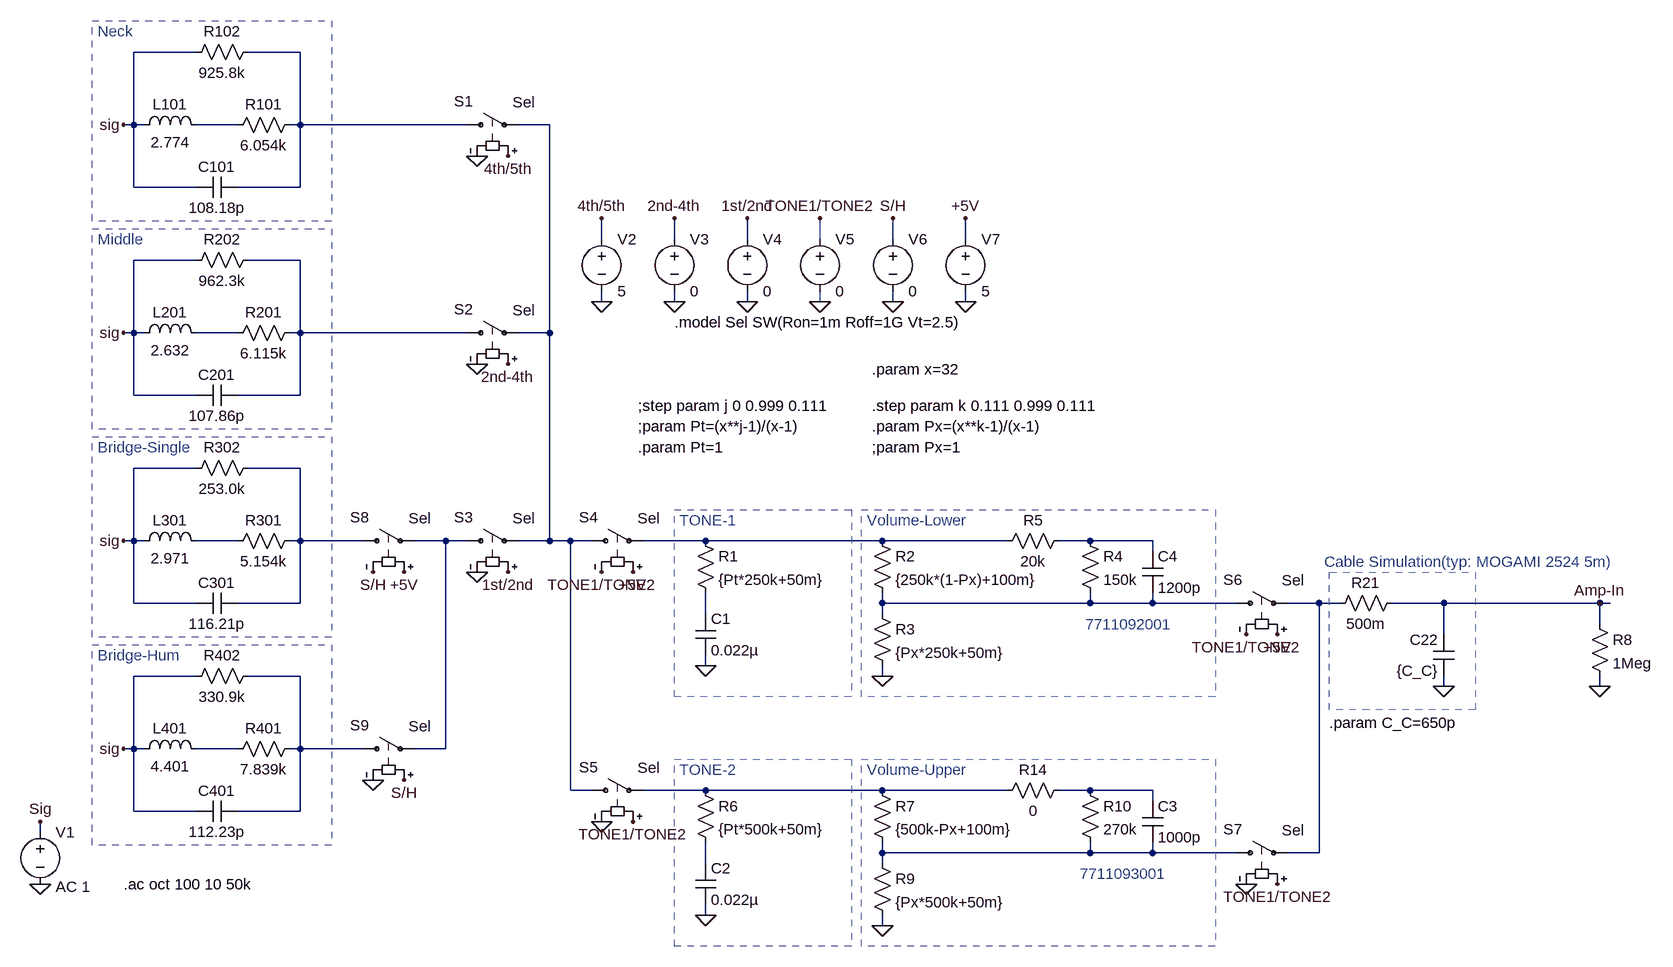
[diagram p0: schematic AM-Pro_Analysis.asc]
AM-Pro_Analysis.asc, the LTspice schematic file:
Version 4.1
SHEET 1 1576 1092
WIRE -672 -768 -768 -768
WIRE -512 -768 -592 -768
WIRE -768 -656 -768 -768
WIRE -768 -656 -784 -656
WIRE -752 -656 -768 -656
WIRE -608 -656 -672 -656
WIRE -512 -656 -512 -768
WIRE -512 -656 -528 -656
WIRE -256 -656 -512 -656
WIRE -128 -656 -176 -656
WIRE -768 -560 -768 -656
WIRE -672 -560 -768 -560
WIRE -512 -560 -512 -656
WIRE -512 -560 -608 -560
WIRE -48 -480 -48 -512
WIRE 64 -480 64 -512
WIRE 176 -480 176 -512
WIRE 288 -480 288 -512
WIRE 400 -480 400 -512
WIRE 512 -480 512 -512
WIRE -672 -448 -768 -448
WIRE -512 -448 -592 -448
WIRE -48 -384 -48 -400
WIRE 64 -384 64 -400
WIRE 176 -384 176 -400
WIRE 288 -384 288 -400
WIRE 400 -384 400 -400
WIRE 512 -384 512 -400
WIRE -768 -336 -768 -448
WIRE -768 -336 -784 -336
WIRE -752 -336 -768 -336
WIRE -608 -336 -672 -336
WIRE -512 -336 -512 -448
WIRE -512 -336 -528 -336
WIRE -256 -336 -512 -336
WIRE -128 -336 -128 -656
WIRE -128 -336 -176 -336
WIRE -768 -240 -768 -336
WIRE -672 -240 -768 -240
WIRE -512 -240 -512 -336
WIRE -512 -240 -608 -240
WIRE -672 -128 -768 -128
WIRE -512 -128 -592 -128
WIRE -768 -16 -768 -128
WIRE -768 -16 -784 -16
WIRE -752 -16 -768 -16
WIRE -608 -16 -672 -16
WIRE -512 -16 -512 -128
WIRE -512 -16 -528 -16
WIRE -416 -16 -512 -16
WIRE -288 -16 -336 -16
WIRE -256 -16 -288 -16
WIRE -128 -16 -128 -336
WIRE -128 -16 -176 -16
WIRE -96 -16 -128 -16
WIRE -64 -16 -96 -16
WIRE 112 -16 16 -16
WIRE 384 -16 112 -16
WIRE 576 -16 384 -16
WIRE 704 -16 656 -16
WIRE 800 -16 704 -16
WIRE 800 0 800 -16
WIRE -768 80 -768 -16
WIRE -672 80 -768 80
WIRE -512 80 -512 -16
WIRE -512 80 -608 80
WIRE 384 80 384 64
WIRE 704 80 704 64
WIRE 704 80 384 80
WIRE 800 80 800 64
WIRE 800 80 704 80
WIRE 928 80 800 80
WIRE 1056 80 1008 80
WIRE 1088 80 1056 80
WIRE 1248 80 1168 80
WIRE 1488 80 1248 80
WIRE 1504 80 1488 80
WIRE 112 96 112 64
WIRE 384 96 384 80
WIRE 1488 112 1488 80
WIRE 1248 128 1248 80
WIRE 112 176 112 160
WIRE -672 192 -768 192
WIRE -512 192 -592 192
WIRE 384 192 384 176
WIRE 1248 208 1248 192
WIRE 1488 208 1488 192
WIRE -768 304 -768 192
WIRE -768 304 -784 304
WIRE -752 304 -768 304
WIRE -608 304 -672 304
WIRE -512 304 -512 192
WIRE -512 304 -528 304
WIRE -416 304 -512 304
WIRE -288 304 -288 -16
WIRE -288 304 -336 304
WIRE -96 368 -96 -16
WIRE -64 368 -96 368
WIRE 112 368 16 368
WIRE 384 368 112 368
WIRE 576 368 384 368
WIRE 704 368 656 368
WIRE 800 368 704 368
WIRE 800 384 800 368
WIRE -768 400 -768 304
WIRE -672 400 -768 400
WIRE -512 400 -512 304
WIRE -512 400 -608 400
WIRE -912 432 -912 416
WIRE 384 464 384 448
WIRE 704 464 704 448
WIRE 704 464 384 464
WIRE 800 464 800 448
WIRE 800 464 704 464
WIRE 928 464 800 464
WIRE 1056 464 1056 80
WIRE 1056 464 1008 464
WIRE 112 480 112 448
WIRE 384 480 384 464
WIRE 112 560 112 544
WIRE 384 576 384 560
FLAG -912 512 0
FLAG 112 176 0
FLAG 384 192 0
FLAG 1248 208 0
FLAG 1488 80 Amp-In
FLAG 1488 208 0
FLAG -240 -608 0
FLAG -240 -288 0
FLAG -240 32 0
FLAG -48 -384 0
FLAG -48 -512 4th/5th
FLAG 64 -512 2nd-4th
FLAG 176 -512 1st/2nd
FLAG 64 -384 0
FLAG 176 -384 0
FLAG 288 -512 TONE1/TONE2
FLAG 288 -384 0
FLAG 400 -512 S/H
FLAG 400 -384 0
FLAG 0 32 +5V
FLAG -48 416 0
FLAG -192 32 1st/2nd
FLAG -192 -288 2nd-4th
FLAG -192 -608 4th/5th
FLAG 992 128 +5V
FLAG 944 512 0
FLAG 112 560 0
FLAG 384 576 0
FLAG -400 32 S/H
FLAG -352 32 +5V
FLAG -352 352 S/H
FLAG -400 352 0
FLAG -912 416 Sig
FLAG -784 -656 sig
FLAG 512 -512 +5V
FLAG 512 -384 0
FLAG -48 32 TONE1/TONE2
FLAG 0 416 TONE1/TONE2
FLAG 944 128 TONE1/TONE2
FLAG 992 512 TONE1/TONE2
FLAG -784 -336 sig
FLAG -784 304 sig
FLAG -784 -16 sig
SYMBOL voltage -912 416 R0
WINDOW 3 30 134 Left 2
WINDOW 123 24 100 Left 2
WINDOW 39 24 72 Left 2
SYMATTR Value ""
SYMATTR Value2 AC 1
SYMATTR InstName V1
SYMBOL cap 96 96 R0
SYMATTR InstName C1
SYMATTR Value 0.022µ
SYMBOL res 96 -32 R0
SYMATTR InstName R1
SYMATTR Value {Pt*250k+50m}
SYMBOL res 368 -32 R0
SYMATTR InstName R2
SYMATTR Value {250k*(1-Px)+100m}
SYMBOL res 368 80 R0
SYMATTR InstName R3
SYMATTR Value {Px*250k+50m}
SYMBOL res 688 -32 R0
SYMATTR InstName R4
SYMATTR Value 150k
SYMBOL cap 784 0 R0
SYMATTR InstName C4
SYMATTR Value 1200p
SYMBOL Res 1184 64 R90
WINDOW 0 0 56 VBottom 2
WINDOW 3 32 56 VTop 2
SYMATTR InstName R21
SYMATTR Value 500m
SYMBOL Cap 1264 192 R180
WINDOW 0 24 56 Left 2
WINDOW 3 24 8 Left 2
SYMATTR InstName C22
SYMATTR Value {C_C}
SYMBOL Res 1472 96 R0
SYMATTR InstName R8
SYMATTR Value 1Meg
SYMBOL res -512 -672 R90
WINDOW 0 0 56 VBottom 2
WINDOW 3 32 56 VTop 2
SYMATTR InstName R101
SYMATTR Value 6.054k
SYMBOL ind -768 -640 R270
WINDOW 0 32 56 VTop 2
WINDOW 3 5 56 VBottom 2
SYMATTR InstName L101
SYMATTR Value 2.774
SYMBOL sw -272 -656 R270
WINDOW 0 36 -3 VRight 2
WINDOW 3 35 87 VRight 2
SYMATTR InstName S1
SYMATTR Value Sel
SYMBOL sw -272 -336 R270
WINDOW 0 36 -3 VRight 2
WINDOW 3 35 87 VRight 2
SYMATTR InstName S2
SYMATTR Value Sel
SYMBOL sw -272 -16 R270
WINDOW 0 36 -3 VRight 2
WINDOW 3 35 87 VRight 2
SYMATTR InstName S3
SYMATTR Value Sel
SYMBOL voltage -48 -496 R0
WINDOW 123 0 0 Left 0
WINDOW 39 0 0 Left 0
SYMATTR InstName V2
SYMATTR Value 5
SYMBOL voltage 64 -496 R0
WINDOW 123 0 0 Left 0
WINDOW 39 0 0 Left 0
SYMATTR InstName V3
SYMATTR Value 0
SYMBOL voltage 176 -496 R0
WINDOW 123 0 0 Left 0
WINDOW 39 0 0 Left 0
SYMATTR InstName V4
SYMATTR Value 0
SYMBOL res 672 -32 R90
WINDOW 0 0 56 VBottom 2
WINDOW 3 32 56 VTop 2
SYMATTR InstName R5
SYMATTR Value 20k
SYMBOL voltage 288 -496 R0
WINDOW 123 0 0 Left 0
WINDOW 39 0 0 Left 0
SYMATTR InstName V5
SYMATTR Value 0
SYMBOL sw -80 -16 R270
WINDOW 0 36 -3 VRight 2
WINDOW 3 35 87 VRight 2
SYMATTR InstName S4
SYMATTR Value Sel
SYMBOL voltage 400 -496 R0
WINDOW 123 0 0 Left 0
WINDOW 39 0 0 Left 0
SYMATTR InstName V6
SYMATTR Value 0
SYMBOL sw -80 368 R270
WINDOW 0 36 -3 VRight 2
WINDOW 3 35 87 VRight 2
SYMATTR InstName S5
SYMATTR Value Sel
SYMBOL sw 912 80 R270
WINDOW 0 36 -3 VRight 2
WINDOW 3 35 87 VRight 2
SYMATTR InstName S6
SYMATTR Value Sel
SYMBOL sw 912 464 R270
WINDOW 0 36 -3 VRight 2
WINDOW 3 35 87 VRight 2
SYMATTR InstName S7
SYMATTR Value Sel
SYMBOL cap 96 480 R0
SYMATTR InstName C2
SYMATTR Value 0.022µ
SYMBOL res 96 352 R0
SYMATTR InstName R6
SYMATTR Value {Pt*500k+50m}
SYMBOL res 368 352 R0
SYMATTR InstName R7
SYMATTR Value {500k-Px+100m}
SYMBOL res 368 464 R0
SYMATTR InstName R9
SYMATTR Value {Px*500k+50m}
SYMBOL res 688 352 R0
SYMATTR InstName R10
SYMATTR Value 270k
SYMBOL cap 784 384 R0
SYMATTR InstName C3
SYMATTR Value 1000p
SYMBOL res 672 352 R90
WINDOW 0 0 56 VBottom 2
WINDOW 3 32 56 VTop 2
SYMATTR InstName R14
SYMATTR Value 0
SYMBOL sw -432 -16 R270
WINDOW 0 36 -3 VRight 2
WINDOW 3 35 87 VRight 2
SYMATTR InstName S8
SYMATTR Value Sel
SYMBOL sw -432 304 R270
WINDOW 0 36 -3 VRight 2
WINDOW 3 35 87 VRight 2
SYMATTR InstName S9
SYMATTR Value Sel
SYMBOL voltage 512 -496 R0
WINDOW 123 0 0 Left 0
WINDOW 39 0 0 Left 0
SYMATTR InstName V7
SYMATTR Value 5
SYMBOL res -576 -784 R90
WINDOW 0 0 56 VBottom 2
WINDOW 3 32 56 VTop 2
SYMATTR InstName R102
SYMATTR Value 925.8k
SYMBOL cap -608 -576 R90
WINDOW 0 0 32 VBottom 2
WINDOW 3 32 32 VTop 2
SYMATTR InstName C101
SYMATTR Value 108.18p
SYMBOL res -512 -352 R90
WINDOW 0 0 56 VBottom 2
WINDOW 3 32 56 VTop 2
SYMATTR InstName R201
SYMATTR Value 6.115k
SYMBOL ind -768 -320 R270
WINDOW 0 32 56 VTop 2
WINDOW 3 5 56 VBottom 2
SYMATTR InstName L201
SYMATTR Value 2.632
SYMBOL res -576 -464 R90
WINDOW 0 0 56 VBottom 2
WINDOW 3 32 56 VTop 2
SYMATTR InstName R202
SYMATTR Value 962.3k
SYMBOL cap -608 -256 R90
WINDOW 0 0 32 VBottom 2
WINDOW 3 32 32 VTop 2
SYMATTR InstName C201
SYMATTR Value 107.86p
SYMBOL res -512 288 R90
WINDOW 0 0 56 VBottom 2
WINDOW 3 32 56 VTop 2
SYMATTR InstName R401
SYMATTR Value 7.839k
SYMBOL ind -768 320 R270
WINDOW 0 32 56 VTop 2
WINDOW 3 5 56 VBottom 2
SYMATTR InstName L401
SYMATTR Value 4.401
SYMBOL res -576 176 R90
WINDOW 0 0 56 VBottom 2
WINDOW 3 32 56 VTop 2
SYMATTR InstName R402
SYMATTR Value 330.9k
SYMBOL cap -608 384 R90
WINDOW 0 0 32 VBottom 2
WINDOW 3 32 32 VTop 2
SYMATTR InstName C401
SYMATTR Value 112.23p
SYMBOL res -512 -32 R90
WINDOW 0 0 56 VBottom 2
WINDOW 3 32 56 VTop 2
SYMATTR InstName R301
SYMATTR Value 5.154k
SYMBOL ind -768 0 R270
WINDOW 0 32 56 VTop 2
WINDOW 3 5 56 VBottom 2
SYMATTR InstName L301
SYMATTR Value 2.971
SYMBOL res -576 -144 R90
WINDOW 0 0 56 VBottom 2
WINDOW 3 32 56 VTop 2
SYMATTR InstName R302
SYMATTR Value 253.0k
SYMBOL cap -608 64 R90
WINDOW 0 0 32 VBottom 2
WINDOW 3 32 32 VTop 2
SYMATTR InstName C301
SYMATTR Value 116.21p
TEXT -784 512 Left 2 !.ac oct 100 10 50k
TEXT 1064 16 Left 2 ;Cable Simulation(typ: MOGAMI 2524 5m)
TEXT 368 -280 Left 2 !.param x=32
TEXT 368 -192 Left 2 !.param Px=(x**k-1)/(x-1)
TEXT 368 -224 Left 2 !.step param k 0.111 0.999 0.111
TEXT 368 -160 Left 2 !;param Px=1
TEXT 1072 264 Left 2 !.param C_C=650p
TEXT 8 -192 Left 2 !;param Pt=(x**j-1)/(x-1)
TEXT 8 -160 Left 2 !.param Pt=1
TEXT -824 -800 Left 2 ;Neck
TEXT 64 -352 Left 2 !.model Sel SW(Ron=1m Roff=1G Vt=2.5)
TEXT 72 -48 Left 2 ;TONE-1
TEXT 360 -48 Left 2 ;Volume-Lower
TEXT 72 336 Left 2 ;TONE-2
TEXT 360 336 Left 2 ;Volume-Upper
TEXT 696 112 Left 2 ;7711092001
TEXT 688 496 Left 2 ;7711093001
TEXT 8 -224 Left 2 !;step param j 0 0.999 0.111
TEXT -824 -480 Left 2 ;Middle
TEXT -824 160 Left 2 ;Bridge-Hum
TEXT -824 -160 Left 2 ;Bridge-Single
RECTANGLE Normal 64 -64 336 224 2
RECTANGLE Normal 352 -64 896 224 2
RECTANGLE Normal 1072 32 1296 244 2
RECTANGLE Normal -464 -508 -832 -816 2
RECTANGLE Normal 64 320 336 608 2
RECTANGLE Normal 352 320 896 608 2
RECTANGLE Normal -464 -188 -832 -496 2
RECTANGLE Normal -464 132 -832 -176 2
RECTANGLE Normal -464 452 -832 144 2

The netlist it stands for:
* AM-Pro_Analysis.asc
V1 Sig 0 AC 1
C1 N013 0 0.022µ
R1 N009 N013 {Pt*250k+50m}
R2 N009 N011 {250k*(1-Px)+100m}
R3 N011 0 {Px*250k+50m}
R4 N010 N011 150k
C4 N010 N011 1200p
R21 Amp-In N012 500m
C22 0 Amp-In {C_C}
R8 Amp-In 0 1Meg
R101 N001 N002 6.054k
L101 Sig N002 2.774
S1 N001 N003 4th/5th 0 Sel
S2 N004 N003 2nd-4th 0 Sel
S3 N008 N003 1st/2nd 0 Sel
V2 4th/5th 0 5
V3 2nd-4th 0 0
V4 1st/2nd 0 0
R5 N010 N009 20k
V5 TONE1/TONE2 0 0
S4 N003 N009 +5V TONE1/TONE2 Sel
V6 S/H 0 0
S5 N003 N016 TONE1/TONE2 0 Sel
S6 N011 N012 +5V TONE1/TONE2 Sel
S7 N018 N012 TONE1/TONE2 0 Sel
C2 N019 0 0.022µ
R6 N016 N019 {Pt*500k+50m}
R7 N016 N018 {500k-Px+100m}
R9 N018 0 {Px*500k+50m}
R10 N017 N018 270k
C3 N017 N018 1000p
R14 N017 N016 0
S8 N006 N008 +5V S/H Sel
S9 N014 N008 S/H 0 Sel
V7 +5V 0 5
R102 N001 Sig 925.8k
C101 N001 Sig 108.18p
R201 N004 N005 6.115k
L201 Sig N005 2.632
R202 N004 Sig 962.3k
C201 N004 Sig 107.86p
R401 N014 N015 7.839k
L401 Sig N015 4.401
R402 N014 Sig 330.9k
C401 N014 Sig 112.23p
R301 N006 N007 5.154k
L301 Sig N007 2.971
R302 N006 Sig 253.0k
C301 N006 Sig 116.21p
.ac oct 100 10 50k
* Cable Simulation(typ: MOGAMI 2524 5m)
.param x=32
.param Px=(x**k-1)/(x-1)
.step param k 0.111 0.999 0.111
;param Px=1
.param C_C=650p
;param Pt=(x**j-1)/(x-1)
.param Pt=1
* Neck
.model Sel SW(Ron=1m Roff=1G Vt=2.5)
* TONE-1
* Volume-Lower
* TONE-2
* Volume-Upper
* 7711092001
* 7711093001
;step param j 0 0.999 0.111
* Middle
* Bridge-Hum
* Bridge-Single
.backanno
.end